# EasyEDA Pro project ProProject_XIAO_NRF52833_2024-01-15.epro, board PCB1
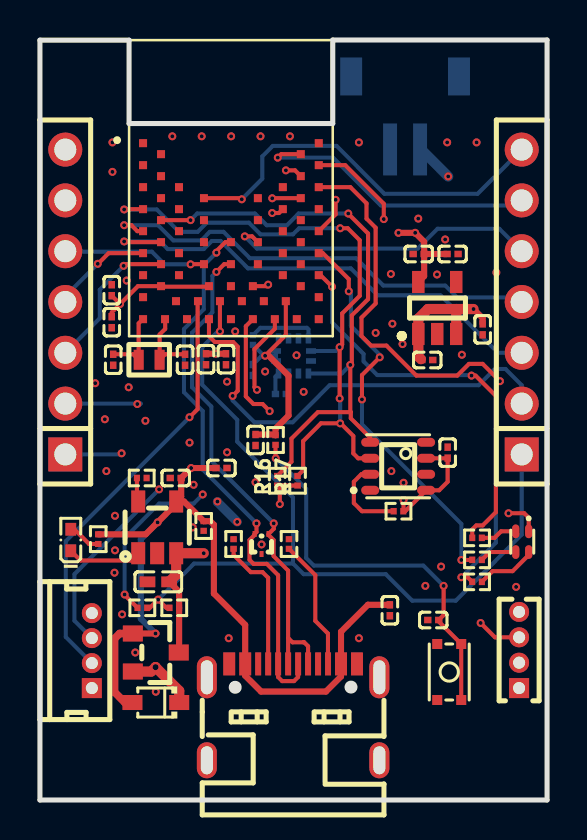
[diagram p7: board, top side]
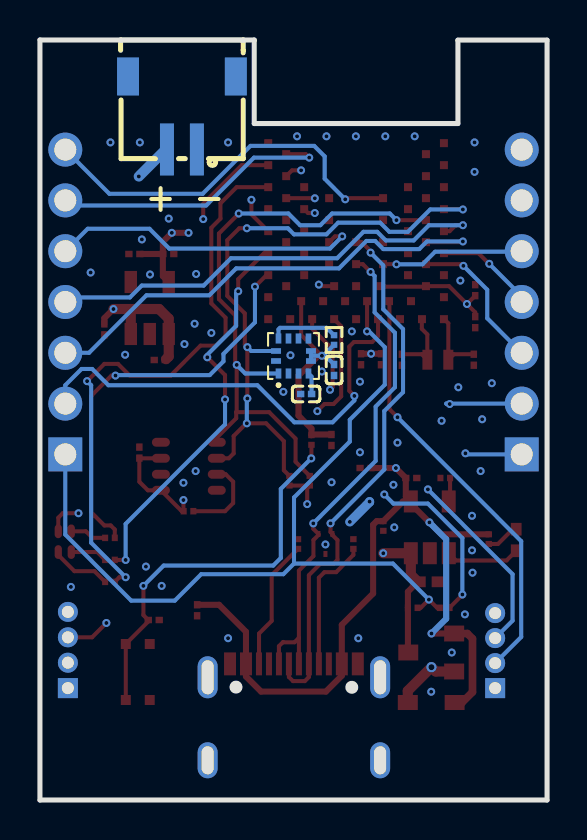
[diagram p8: board, bottom side, seen from below]

Outline 25.4 x 38 mm; copper layers: Top Layer, Inner1, Inner2, Bottom Layer. Coordinates in mm from the lower left corner of the outline.
Outline path: 0,0 0,37.99 4.47,37.99 4.47,33.82 14.67,33.82 14.67,38 25.4,38 25.4,0 0,0
Stack: Top Layer 0.035mm / Dielectric1 0.48mm PP er 4.5 / Inner1 0.035mm / Dielectric2 0.48mm FR4 er 4.5 / Inner2 0.035mm / Dielectric3 0.48mm PP er 4.5 / Bottom Layer 0.035mm

## Design rules (mm)
template: Custom Config
spacing copperThickness1oz (default): track to track 0.102, other pairs 0 to 0.3
spacing copperThickness2oz: track to track 0.203, other pairs 0.152 to 0.3
track width copperThickness1oz (default): min 0.127, default 0.254, max 2.54
track width copperThickness2oz: min 0.203, default 0.254, max 2.54
differential pair differentialPair (default): width min 0.127, default 0.254, max 2.54; gap min 0.152, default 0.152
via viaSize (default): diameter min 0.399, default 0.61, max 10; hole min 0.201, default 0.305, max 6.299

## Placement (name value [footprint] x y rotation side)
C1  100nF  [C0201]  17.53 9.49 90 top
C16  10uF  [C0402]  5.93 10.91 0 top
C17  4.7uF  [C0201]  6.8 16.1 0 top
C24  4.7uF  [C0201]  22.17 23.53 90 top
C25  100nF  [C0201]  19.4 22 0 top
C26  4.7uF  [C0201]  20.67 27.3 180 top
C27  100nF  [C0201]  18.97 27.3 180 top
C28  100nF  [C0201]  19.7 9 0 top
C29  100nF  [C0201]  12.07 20.3 0 bottom
C30  1uF  [C0201]  10.67 21.5 270 bottom
C32  100nF  [C0201]  20.42 17.37 270 top
C35  4.7uF  [C0201]  9.09 16.6 180 top
C38  100nF  [C0201]  10.8 18 270 top
C46  100nF  [C0201]  3.6 23.89 270 top
C47  100nF  [C0201]  3.6 25.49 90 top
C49  12pF  [C0201]  3.67 22.01 90 top
C50  12pF  [C0201]  7.27 22.01 90 top
C51  4.7uF  [C0201]  8.32 22.04 90 top
C60  100nF  [C0201]  9.32 22.04 270 top
CN1  HC-ZH-2PWT  [CONN-SMD_2P-P1.50_HCTL_HC-ZH-2PWT]  18.29 34.35 0 bottom
CN3  1.25T-4A  [CONN-TH_11.25T-4A]  2.6 7.47 90 top
D2  1N5819WS  [SOD-323_L1.8-W1.3-LS2.5-RD]  5.8 4.87 180 top
D3  TPD2EUSB30DRTR  [SOT-9X3-3_L1.0-W0.8-P0.35-LS1.0-BR]  11.1 12.8 90 top
H1  PZ254V-11-07P  [HDR-TH_7P-P2.54-V-M]  1.27 24.9 90 top
H2  PZ254V-11-07P  [HDR-TH_7P-P2.54-V-M]  24.13 24.9 90 top
H3  PZ127V-11-04-0720  [HDR-TH_4P-P1.27-V-M]  24 7.5 90 top
LED1  16-213SDRC/S530-A3/TR8  [LED0402-RD]  1.54 13 90 top
LED2  FC-B1010RGBT-HG  [LED-ARRAY-SMD_4P-L1.0-W1.0-TR-RD]  24.16 12.92 0 top
Q1  AO3401A  [SOT-23_L2.9-W1.3-P1.90-LS2.4-BR]  5.8 7.37 180 top
R1  5.1kΩ  [R0201]  9.7 12.8 270 top
R2  5.1kΩ  [R0201]  12.48 12.8 90 top
R3  2.2kΩ  [R0201]  2.92 13.04 90 top
R4  510kΩ  [R0201]  6.73 9.61 0 top
R5  10kΩ  [R0201]  5.1 16.1 180 top
R6  100kΩ  [R0201]  8.2 13.7 90 top
R7  1MΩ  [R0201]  5.13 9.61 180 top
R8  100kΩ  [R0201]  11.8 18 90 top
R9  2.2kΩ  [R0201]  21.89 13.11 0 top
R10  2.2kΩ  [R0201]  21.89 12.01 0 top
R11  2.2kΩ  [R0201]  21.89 10.91 0 top
R14  10kΩ  [R0201]  10.67 23 270 bottom
R15  10kΩ  [R0201]  17.96 14.44 0 top
R16  10kΩ  [R0201]  11.89 15.96 270 top
R17  10kΩ  [R0201]  12.9 15.96 270 top
SW2  TS-1928-B  [KEY-SMD_4P-L2.8-W2.0-P1.20-LS3.0-TL]  20.5 6.4 270 top
U3  TP4054  [TSOT-23-5_L2.9-W1.6-P0.95-LS2.8-BR]  5.87 13.63 270 top
U5  AP2112K-3.3TRG1  [SOT-25-5_L2.9-W1.6-P0.95-LS2.8-BL]  19.9 24.6 0 top
U6  LIS3MDLTR  [LGA-12_L2.0-W2.0-P0.50-BL]  12.7 22.2 180 bottom
U9  BME680  [LGA-8_L3.0-W3.0-P0.80-TR]  17.94 16.69 180 top
U10  -  [XCVR_BM833E]  9.57 30.49 0 top
USB1  TYPEC-304-ACP16  [USB-C-SMD_TYPE-C-16P-1]  12.68 4.4 0 top
X4  32.768kHz  [CRYSTAL-SMD_L1.7-W1.1]  5.47 22.01 180 top

## Footprints (pads in the part's own frame, mm; a bottom-side part is the same pattern mirrored in y, then rotated)
C0201
  rect 0.368x0.324 smd: 1(-0.275,0) 2(0.275,0)
C0402
  rect 0.79x0.54 smd: 1(-0.545,0) 2(0.545,0)
CONN-SMD_2P-P1.50_HCTL_HC-ZH-2PWT
  rect 0.7x2.6 smd: 1(-0.75,1.825) 2(0.75,1.825)
  rect 1.1x1.9 smd: 3(2.7,-1.825) 4(-2.7,-1.825)
CONN-TH_11.25T-4A
  rect 1x1 hole 0.6: 1(-1.875,0)
  round 1 hole 0.6: 2(-0.625,0) 3(0.625,0) 4(1.875,0)
CRYSTAL-SMD_L1.7-W1.1
  rect 0.5x1 smd: 1(-0.525,0) 2(0.525,0)
HDR-TH_4P-P1.27-V-M
  rect 1x1 hole 0.6: 1(-1.905,0)
  round 1 hole 0.6: 2(-0.635,0) 3(0.635,0) 4(1.905,0)
HDR-TH_7P-P2.54-V-M
  rect 1.7x1.7 hole 1.1: 1(-7.62,0)
  round 1.7 hole 1.1: 2(-5.08,0) 3(-2.54,0) 4(0,0) 5(2.54,0) 6(5.08,0) 7(7.62,0)
KEY-SMD_4P-L2.8-W2.0-P1.20-LS3.0-TL
  rect 0.5x0.5 smd: 1(-1.4,0.6) 2(1.4,0.6) 3(-1.4,-0.6) 4(1.4,-0.6)
LED0402-RD
  rect 0.636x0.54 smd: 1(-0.538,0) 2(0.538,0)
LED-ARRAY-SMD_4P-L1.0-W1.0-TR-RD
  oval 0.364x0.687 smd: 1(0.325,0.518) 2(0.325,-0.518) 3(-0.325,-0.518) 4(-0.325,0.518)
LGA-8_L3.0-W3.0-P0.80-TR
  oval 0.9x0.448 smd: 1(1.4,1.2) 2(1.4,0.4) 3(1.4,-0.4) 4(1.4,-1.2) 5(-1.4,-1.2) 6(-1.4,-0.4) 7(-1.4,0.4) 8(-1.4,1.2)
LGA-12_L2.0-W2.0-P0.50-BL
  rect 0.28x0.5 smd: 1(-0.75,-0.875) 2(-0.25,-0.875) 3(0.25,-0.875) 4(0.75,-0.875) 7(0.75,0.875) 8(0.25,0.875) 9(-0.25,0.875) 10(-0.75,0.875)
  rect 0.5x0.28 smd: 5(0.875,-0.25) 6(0.875,0.25) 11(-0.875,0.25) 12(-0.875,-0.25)
R0201
  rect 0.303x0.324 smd: 1(-0.241,0) 2(0.241,0)
SOD-323_L1.8-W1.3-LS2.5-RD
  rect 1x0.75 smd: 1(-1.173,0) 2(1.173,0)
SOT-9X3-3_L1.0-W0.8-P0.35-LS1.0-BR
  rect 0.3x0.2 smd: 1(0.5,-0.35) 2(0.5,0.35) 3(-0.5,0)
SOT-23_L2.9-W1.3-P1.90-LS2.4-BR
  rect 1x0.8 smd: 1(1.15,-0.95) 2(1.15,0.95) 3(-1.15,0)
SOT-25-5_L2.9-W1.6-P0.95-LS2.8-BL
  rect 0.623x1.105 smd: 1(-0.95,-1.3) 2(-0.001,-1.3) 3(0.95,-1.3) 4(0.95,1.3) 5(-0.95,1.3)
TSOT-23-5_L2.9-W1.6-P0.95-LS2.8-BR
  rect 1.1x0.7 smd: 1(1.294,-0.951) 2(1.294,-0.001) 3(1.294,0.951) 4(-1.294,0.951) 5(-1.294,-0.949)
USB-C-SMD_TYPE-C-16P-1
  rect 0.6x1.15 smd: A1B12(-3.2,2.41) A4B9(-2.4,2.41) B1A12(3.2,2.41) B4A9(2.4,2.41)
  rect 0.3x1.15 smd: A5(-1.25,2.41) A6(-0.25,2.41) A7(0.25,2.41) A8(1.25,2.41) B5(1.75,2.41) B6(0.75,2.41) B7(-0.75,2.41) B8(-1.75,2.41)
  oval 1x2.1 hole 0.6x1.7: EP(-4.32,1.74) EP(4.32,1.74)
  oval 1x1.8 hole 0.6x1.4: EP(-4.32,-2.41) EP(4.32,-2.41)
XCVR_BM833E
  rect 0.4x0.4 smd: 1(-4.4,2.35) 2(-3.5,1.8) 3(-4.4,1.25) 4(-3.5,0.7) 5(-4.4,0.15) 6(-3.5,-0.4) 7(-4.4,-0.95) 8(-3.5,-1.5) 9(-4.4,-2.05) 10(-3.5,-2.6) 11(-4.4,-3.15) 12(-3.5,-3.7) 13(-4.4,-4.25) 14(-3.5,-4.8) 15(-4.4,-5.35) 16(-4.4,-6.45) 17(-3.3,-6.45) 18(-2.75,-5.55) 19(-2.2,-6.45) 20(-1.65,-5.55) 21(-1.1,-6.45) 22(-0.55,-5.55) 23(0,-6.45) 24(0.55,-5.55) 25(1.1,-6.45) 26(1.65,-5.55) 27(2.2,-6.45) 28(2.75,-5.55) 29(3.3,-6.45) 30(4.4,-6.45) 31(4.4,-5.35) 32(3.5,-4.8) 33(4.4,-4.25) 34(3.5,-3.7) 35(4.4,-3.15) 36(3.5,-2.6) 37(4.4,-2.05) 38(3.5,-1.5) 39(4.4,-0.95) 40(3.5,-0.4) 41(4.4,0.15) 42(3.5,0.7) 43(4.4,1.25) 44(3.5,1.8) 45(4.4,2.35) 46(1.35,-0.4) 47(-1.35,-0.4) 48(-2.6,0.15) 49(-2.6,-0.95) 50(-1.35,-1.5) 51(-2.6,-2.05) 52(-1.35,-2.6) 53(-2.6,-3.15) 54(-1.35,-3.7) 55(-2.6,-4.25) 56(-1.1,-4.8) 57(0,-4.8) 58(1.1,-4.8) 59(2.6,-4.25) 60(1.35,-3.7) 61(2.6,-3.15) 62(1.35,-2.6) 63(2.6,-2.05) 64(1.35,-1.5) 65(2.6,-0.95) 66(2.6,0.15) 67(0,-3.7) 68(0,-2.6)

## Nets
As in the schematic.

Pads without a net: CN1 4; U5 4; U6 7 8; U10 6 23 24 26 29 31 32 34 36 38 39 46 48 49 50 51 52 53 55 57 59 60 61 63 64; USB1 A8 B8

## Via types
v1: diameter 0.399, hole 0.201, Top Layer to Bottom Layer, 113 vias
v2: diameter 0.508, hole 0.305, Top Layer to Bottom Layer, 1 via

## Routing (per net, layer and track width the routed paths; a pad name or vN(x,y) marks a point on that pad's centre or on a via; arc(x,y) is an arc through that point)
GND:
  vias: v1(2.77,20.84) v1(3.25,19.04) v1(3.33,16.45) v1(3.63,32.88) v1(3.63,31.41) v1(3.73,11.37) v1(3.76,14.21) v1(3.76,12.48) v1(4.11,9.28) v1(4.34,25.97) v1(4.44,20.64) v1(4.77,7.37) v1(5.28,18.96) v1(5.8,5.41) v1(6.63,33.18) v1(7.49,17.87) v1(7.7,15.76) v1(7.65,13.63) v1(8.1,33.18) v1(9.37,20.92) v1(9.46,8.09) v1(9.58,33.18) v1(9.78,23.43) v1(10.79,15.89) v1(11.05,33.18) v1(11.1,12.78) v1(12.52,33.18) v1(12.85,22.24) v1(13.21,20.41) v1(15.98,32.88) v1(15.98,8.09) v1(17.58,26.3) v1(17.6,16.45) v1(17.65,23.81) v1(18.21,15.86) v1(18.95,29.07) v1(19.3,10.71) v1(19.89,26.28) v1(20.09,11.67) v1(20.29,28.03) v1(20.4,32.88) v1(21.13,22.26) v1(21.87,32.88) v1(22.86,26.37) v1(23.85,10.66)
VBUS: length 52.9
  Top Layer w0.203: U10.58 11.35,25.69 v1(11.43,25.77)
  Top Layer w0.305: R3.2 5.3,13.28 v1(5.89,13.88) 6.82,14.81 U3.4 ; U3.4 7.07,15.18 C17.2 v1(7.57,16.6) 8.82,16.6 ; U3.4 7.22,14.93 R6.2 8.53,13.94 8.71,13.76 8.71,10.32 10.28,8.76 USB1.A4B9 10.28,6.22 11.07,5.42 14.33,5.42 15.08,6.18 USB1.B4A9 15.08,8.41 16.43,9.76 17.53,9.76 ; Q1.1 v1(5.79,8.32)
  Top Layer w0.381: 4.63,4.87 4.26,4.87 3.73,5.4 3.73,8.06 3.99,8.32 Q1.1
  Inner2 w0.305: 7.59,16.6 8.18,17.18 8.18,20.58 11.46,23.86 11.46,25.74 v1(11.43,25.77)
  Bottom Layer w0.305: v1(5.89,13.88) 5.05,13.04 5.05,9.06 v1(5.79,8.32)
VDD: length 48.5
  Top Layer w0.305: C24.2 22.17,24.09 v1(21.72,24.55)
  Top Layer w0.508: 19.08,22.04 18.95,22.18 U5.1 18.95,24.07 19.43,24.55 20.86,24.55 ; 20.86,24.55 20.85,24.54 U5.3 ; 20.86,24.55 v1(21.72,24.55) ; D2.1 6.98,5.46 v2(5.79,6.64) 5.57,6.42 Q1.2
  Inner2 w0.508: CN3.1 4.39,5.59 5.44,6.64 v2(5.79,6.64) 5.79,6.92 6.71,7.84 6.71,23.1 10.19,26.58 12.41,26.58 14.34,24.65 21.62,24.65 v1(21.72,24.55)
VDD_NRF: length 48.8
  Top Layer w0.203: LED2.1 24.48,14.11 24.26,14.34 v1(23.47,14.34) ; v1(18.21,15) 18.21,14.52 18.29,14.44 ; U10.56 8.44,25.67 6.09,25.67 U10.14 4.91,25.69 v1(4.01,24.8) ; v1(12.01,14.8) 12.01,15.59 R16.2 R17.2 ; C47.1 v1(4.01,24.8) ; v1(4.01,24.8) 3.6,24.38 3.6,24.17 ; U9.6 20.41,17.09 C32.2 20.42,15.91 19.99,15.49 U9.8 18.29,14.44 ; 18.29,14.44 R15.2 ; U10.28 12.32,23.25 v1(11.28,22.21)
  Top Layer w0.305: v1(17.96,28.36) v1(18.8,28.36) 19.24,27.91 C27.1 ; C60.1 C51.2 ; C38.1 11.77,18.27 R8.2 11.8,18.57 12.45,19.22 12.45,21.22 11.46,22.21 v1(11.28,22.21) ; C27.1 C26.2 ; C27.1 19.24,26.19 U5.5
  Inner1 w0.305: v1(18.21,15) 19.96,15 21.4,13.56 22.69,13.56 v1(23.47,14.34)
  Inner1 w0.508: v1(17.96,28.36) 17.96,27.93 16.61,26.58 16.61,23.56 v1(16.81,23.36) ; v1(8.81,22.31) 8.92,22.21 v1(11.28,22.21)
  Bottom Layer w0.203: 11.82,22.2 11.81,22.21 v1(11.28,22.21) 11.22,22.21 ; 11.82,22.2 U6.6 ; 11.82,22.2 U6.5 ; R14.2 11.22,22.21 ; 11.22,22.21 11.1,22.21 C30.1
  Bottom Layer w0.457: v1(9.88,13.91) 8.89,14.9 v1(8.89,14.92)
AIN0: length 42
  Top Layer w0.203: v1(9.02,23.43) U10.22 ; R7.1 5.51,9.61 v1(5.92,10.02) 6.33,9.61 R4.1
  Bottom Layer w0.203: H2.1 24.13,13.27 20.83,9.97 18.64,9.97 17.32,11.29 13.21,11.29 12.67,11.82 ; 12.67,11.82 12.67,15.12 9.88,17.92 9.88,19.01 8.13,20.76 8.13,22.64 8.92,23.43 v1(9.02,23.43) ; 12.67,11.82 7.72,11.82 v1(5.92,10.02)
AIN1: length 21.4
  Top Layer w0.203: U10.20 7.9,24.92 7.9,19.54 v1(7.49,19.14)
  Bottom Layer w0.203: v1(7.49,19.14) 1.3,12.94 1.3,8.15 CN3.2
AIN2: length 22.6
  Top Layer w0.203: U10.21 8.47,23.19 8.76,22.9 9.68,22.9 9.91,22.67 9.91,20.46 v1(9.65,20.2)
  Bottom Layer w0.203: H2.2 24.13,20.74 23.32,21.55 22.78,21.55 21.97,20.74 14.51,20.74 12.66,18.88 10.74,18.88 9.65,19.98 v1(9.65,20.2)
AIN4: length 22.9
  Top Layer w0.203: U10.9 4.88,28.44 4.58,28.74 v1(4.22,28.74)
  Bottom Layer w0.203: v1(4.22,28.74) 5.92,28.74 6.68,27.98 8.08,27.98 8.51,28.41 9.19,28.41 10.52,27.09 15.83,27.09 17.2,25.72 20.3,25.72 20.89,25.13 23.9,25.13 H2.4
AIN5: length 24.4
  Top Layer w0.203: v1(4.22,27.93) 4.25,27.89 U10.10
  Bottom Layer w0.203: H2.3 22.94,22.36 20.07,25.23 16.92,25.23 15.57,26.58 10.42,26.58 9.05,27.95 8.61,27.95 8.2,27.55 6.4,27.55 6.02,27.93 v1(4.22,27.93)
BAT+: length 35.3
  Top Layer w0.305: C16.2 6.97,10.41 R4.2 6.97,7.39 Q1.3
  Top Layer w0.508: C16.2 6.82,11.26 U3.3 v1(8.2,12.34)
  Inner1 w0.508: v1(20.45,31.18) 21.34,30.29 21.34,25.97 v1(18.16,22.8)
  Inner2 w0.508: v1(18.16,22.8) 18.16,21.57 17.66,21.07 15.01,21.07 13.17,19.23 12.46,19.23 9.64,16.41 9.64,14.68 8.2,13.25 v1(8.2,12.34)
  Bottom Layer w0.508: CN1.2 19.1,32.53 v1(20.45,31.18)
BLUE: length 20.4
  Top Layer w0.203: R9.1 21.65,13.53 21.85,13.73 22.17,13.73 22.83,14.39 22.83,20.2 21.82,21.22 v1(21.62,21.22) ; U10.33 14.05,26.24 v1(14.63,25.67)
  Bottom Layer w0.203: v1(14.63,25.67) 14.63,23.88 16.21,22.3 16.21,21.93 16.89,21.25 21.59,21.25 v1(21.62,21.22)
D+: length 25.3
  Top Layer w0.203: v1(8.84,26.4) 9.23,26.79 U10.67 ; USB1.A6 12.43,8.11 ; 12.43,8.11 12.65,7.89 13.2,7.89 13.22,7.9 13.43,7.69 USB1.B6 ; 12.43,8.11 12.43,11.47 11.7,12.2 11.7,13 11.45,13.25 D3.1 11.71,13.56 v1(11.71,13.83)
  Bottom Layer w0.203: v1(11.71,13.83) 8.58,16.95 8.58,19.67 7.62,20.64 7.62,23.36 8.64,24.38 8.64,26.2 v1(8.84,26.4)
D-: length 27.3
  Top Layer w0.203: USB1.A7 12.93,6.15 12.73,5.94 12.13,5.94 11.93,6.15 USB1.B7 11.93,11.24 11.36,11.81 10.7,11.81 10.5,12.01 10.5,13 10.75,13.25 D3.2 10.85,13.4 v1(10.85,13.83) ; U10.68 9.29,27.89 8.84,27.44 v1(8.84,27.37)
  Bottom Layer w0.203: v1(8.84,27.37) 8.2,26.73 8.2,24.54 7.21,23.55 7.21,20.39 8.15,19.45 8.15,16.52 v1(10.85,13.83)
GREEN: length 19.7
  Top Layer w0.203: v1(15.47,25.44) 15.47,26.04 14.17,27.34 U10.35 ; v1(16.13,20.03) 16.13,21.25 v1(17.02,22.14) ; v1(21.11,12) 21.65,12 R10.1
  Bottom Layer w0.203: v1(21.11,12) 21.11,13.8 16.13,18.78 v1(16.13,20.03) ; v1(17.02,22.14) 17.02,22.26 15.57,23.71 15.57,25.33 v1(15.47,25.44)
P0.17: length 32.6
  Top Layer w0.203: v1(14.81,30.01) 14.81,29.28 U10.37
  Inner2 w0.203: v1(14.81,30.01) 14.78,30.01 13.39,28.61 11.51,28.61 11.3,28.82 9.07,28.82 7.75,27.5 7.54,27.5 5.97,25.92 v1(5.97,15.53)
  Bottom Layer w0.203: CN3.3 1.73,8.97 1.73,11.29 v1(5.97,15.53)
P0.20: length 15.8
  Top Layer w0.203: v1(10.26,28.18) 10.63,28.18 U10.62
  Bottom Layer w0.203: v1(10.26,28.18) 10.87,27.57 18.92,27.57 19.91,28.56 23.01,28.56 H2.5
P0.22: length 14.5
  Top Layer w0.203: U10.44 12.09,32.29 v1(11.91,32.12)
  Bottom Layer w0.203: v1(11.91,32.12) 14.68,32.12 17.07,29.73 23.88,29.73 H2.6
P0.24: length 19.6
  Top Layer w0.203: U10.47 10.05,30.09 v1(10.11,30.03)
  Bottom Layer w0.203: v1(10.11,30.03) 11.14,31.06 11.14,32.18 11.66,32.71 14.85,32.71 17.25,30.31 21.92,30.31 H2.7
READ_BAT: length 25.9
  Top Layer w0.203: U10.65 11.97,29.35 v1(11.63,29.35) ; R7.2 4.24,10.25 v1(4.24,10.27)
  Inner1 w0.203: v1(11.28,21.42) 11.48,21.42 12.09,22.03 12.09,28.89 v1(11.63,29.35)
  Inner2 w0.203: v1(11.28,21.42) 11.48,21.22 11.48,20.28 10.71,19.52 9.8,19.52 8.76,18.48 8.76,15.89 v1(8.15,15.28)
  Bottom Layer w0.203: v1(8.15,15.28) 7.7,14.82 5.97,14.82 4.24,13.09 v1(4.24,10.27)
RED: length 29.4
  Top Layer w0.203: R11.1 21.42,11.14 v1(21.11,11.14) ; v1(23.04,20.94) 22.17,21.81 21.49,21.81 20.9,21.22 18.85,21.22 17.36,22.72 16.59,22.72 16.1,23.2 16.1,24.12 16.81,24.83 16.81,28.61 16.36,29.07 16.36,29.83 15.55,30.64 U10.41
  Bottom Layer w0.203: v1(23.04,20.94) 22.83,20.74 22.83,12.86 v1(21.11,11.14)
RESET: length 38.2
  Top Layer w0.203: R8.1 11.8,17.09 v1(11.81,17.08) ; v1(20.22,10.71) 20.22,9.24 C28.2 19.97,8.93 SW2.1 SW2.2 ; U10.40 11.64,30.09 v1(11.63,30.09)
  Inner1 w0.203: v1(11.63,30.09) 11.05,30.09 9.42,28.46 9.42,25.21 8.03,23.81 8.03,20.33 11.28,17.08 v1(11.81,17.08)
  Bottom Layer w0.203: v1(20.22,10.71) 19.2,11.72 13.72,11.72 13.33,12.1 13.33,15.56 v1(11.81,17.08)
RXD: length 22.1
  Top Layer w0.203: v1(10.87,20.51) 10.74,20.64 10.74,22.54 11.77,23.56 U10.27
  Inner1 w0.203: v1(10.87,20.51) 11.25,20.13 11.68,20.13 13.08,18.73 13.08,17.49 12.13,16.54 11.01,16.54 9.09,18.45 6.96,18.45 5.61,19.8 v1(4.88,19.8)
  Bottom Layer w0.203: v1(4.88,19.8) 5.03,19.8 5.05,19.82 H1.2
SCK1: length 7.5
  Top Layer w0.203: U10.12 4.28,26.79 v1(4.19,26.71)
  Bottom Layer w0.203: v1(4.19,26.71) 3,25.51 3,24.09 H1.3
SCL: length 30.6
  Top Layer w0.203: U9.4 16.54,18.11 15.57,19.09 15.57,19.39 ; v1(15.44,29.32) 15.44,29.32 16.43,28.33 16.43,25.04 15.62,24.23 15.62,21.83 v1(15.54,21.75) 15.54,19.42 15.57,19.39 ; R16.1 12.6,16.92 12.6,18.07 13.92,19.39 15.57,19.39 ; 7.54,28.99 U10.8
  Bottom Layer w0.203: v1(7.54,28.99) 7.87,29.32 10.77,29.32 11.35,28.74 12.37,28.74 12.95,29.32 v1(15.44,29.32) ; v1(15.54,21.75) 15.11,21.33 U6.1
SDA: length 31.9
  Top Layer w0.203: v1(4.22,29.53) 4.23,29.54 U10.7 ; v1(15.04,28.59) 15.42,28.59 16.02,27.99 16.02,25.21 15.14,24.33 15.14,22.77 v1(15.01,22.64) v1(15.01,20.08) ; R17.1 13.18,16.48 13.18,17.94 14.07,18.83 v1(15.04,18.83) 15.06,18.83 15.7,18.2 15.7,17.33 15.94,17.09 U9.3
  Bottom Layer w0.203: v1(15.04,18.83) 15.04,20.05 v1(15.01,20.08) ; v1(15.04,28.59) 12.98,28.59 12.67,28.28 11.05,28.28 10.46,28.87 8.36,28.87 7.9,28.41 6.97,28.41 5.85,29.53 v1(4.22,29.53) ; U6.11 14.82,22.45 v1(15.01,22.64)
SDA1: length 5.1
  Top Layer w0.203: U10.11 3.44,27.34 2.91,26.81 v1(2.9,26.81)
  Bottom Layer w0.203: H1.4 1.27,25.18 v1(2.9,26.81)
SDO1: length 7.2
  Top Layer w0.203: U10.54 7.55,26.79 v1(7.54,26.78)
  Bottom Layer w0.203: v1(7.54,26.78) 6.24,26.78 5.61,27.41 1.3,27.41 H1.5
SWDCLK: length 40.6
  Top Layer w0.203: H3.3 22.79,8.14 v1(22.07,8.85) ; v1(12.32,31.48) 12.77,31.48 U10.42
  Inner2 w0.203: v1(22.07,8.85) 22.07,12.94 15.6,19.42 15.6,20.28 15.88,20.56 20.24,20.56 22.17,22.49 22.17,24.27 22.35,24.45 22.35,25.16 20.78,26.73 18.05,26.73 16.4,28.38 16.4,29.3 14.22,31.48 v1(12.32,31.48)
SWDIO: length 31.6
  Top Layer w0.203: U10.43 15.29,31.74 17.22,29.81 v1(17.22,29.04)
  Inner2 w0.203: v1(17.22,29.04) 17.22,28.26 18.01,27.47 20.68,27.47 22.68,25.46 22.68,22.06 22.38,21.75 22.38,20.66 22.83,20.2 22.83,8.03 H3.2
TXD: length 16.9
  Top Layer w0.203: U10.25 10.31,23.69 10.31,20.18 10.69,19.8 11.15,19.8 v1(11.51,19.44)
  Inner1 w0.203: v1(9.37,17.39) 9.22,17.23 4.19,17.23 v1(4.09,17.33)
  Inner2 w0.203: v1(11.51,19.44) 11.51,19.14 9.75,17.39 v1(9.37,17.39)
  Bottom Layer w0.203: H1.1 4.03,17.28 v1(4.09,17.33)
$1N6010: length 6.8
  Top Layer w0.203: R1.2 9.7,12.25 10.56,11.39 11.15,11.39 11.43,11.11 USB1.A5
$1N6013: length 6.6
  Top Layer w0.203: USB1.B5 14.43,6.81 14.43,8.32 13.79,8.96 13.79,11.24 R2.1
$1N6476: length 1.2
  Top Layer w0.203: R5.2 4.86,14.99 U3.5
$1N7177: length 3.4
  Bottom Layer w0.203: R14.1 11.04,23.61 13.37,23.61 13.45,23.53 U6.10
$1N7737: length 1.1
  Bottom Layer w0.203: U6.4 11.79,21.17 C29.1
$1N8157: length 4.2
  Top Layer w0.203: U9.2 16.1,16.29 15.72,15.91 15.72,14.85 16.13,14.44 R15.1
$1N9194: length 1.8
  Top Layer w0.203: R9.2 22.77,13.11 23.1,13.43 LED2.4
$1N9197: length 1.9
  Top Layer w0.203: LED2.3 22.52,12.4 R10.2
$1N9200: length 3
  Top Layer w0.203: LED2.2 24.48,12.25 23.67,11.44 22.67,11.44 R11.2
$1N15220: length 1.7
  Top Layer w0.203: LED1.2 1.72,13.54 2.46,12.8 R3.1
$1N15223: length 3.7
  Top Layer w0.203: U3.1 4.56,11.98 2.03,11.98 1.54,12.46
$1N34366: length 3.5
  Top Layer w0.203: C49.2 4.67,22.29 X4.2 4.94,23.83 5.17,24.06
$1N34369: length 3.6
  Top Layer w0.203: C50.2 6.27,22.29 X4.1 5.99,23.28 6.27,23.56 6.27,24.06

## Copper pours and planes (outline as drawn; the poured copper is in the pictures)
GND on Top Layer: -4.22,39.05 28.67,39.05 28.67,-0.54 -4.22,-0.54
GND on Bottom Layer: -4.37,39.28 28.75,39.28 28.75,-0.54 -4.37,-0.54
GND on Inner1: -4.45,39.18 28.88,39.18 28.88,-0.85 -4.45,-0.85
VDD_NRF on Inner2: -4.57,39.31 28.96,39.31 28.96,-0.93 -4.57,-0.93

## Text on the board
Bottom Silkscreen Layer: + -
